# EAGLE schematic EurocardBackplane (EAGLE 6.6.0)

## Sheet 1 of 8
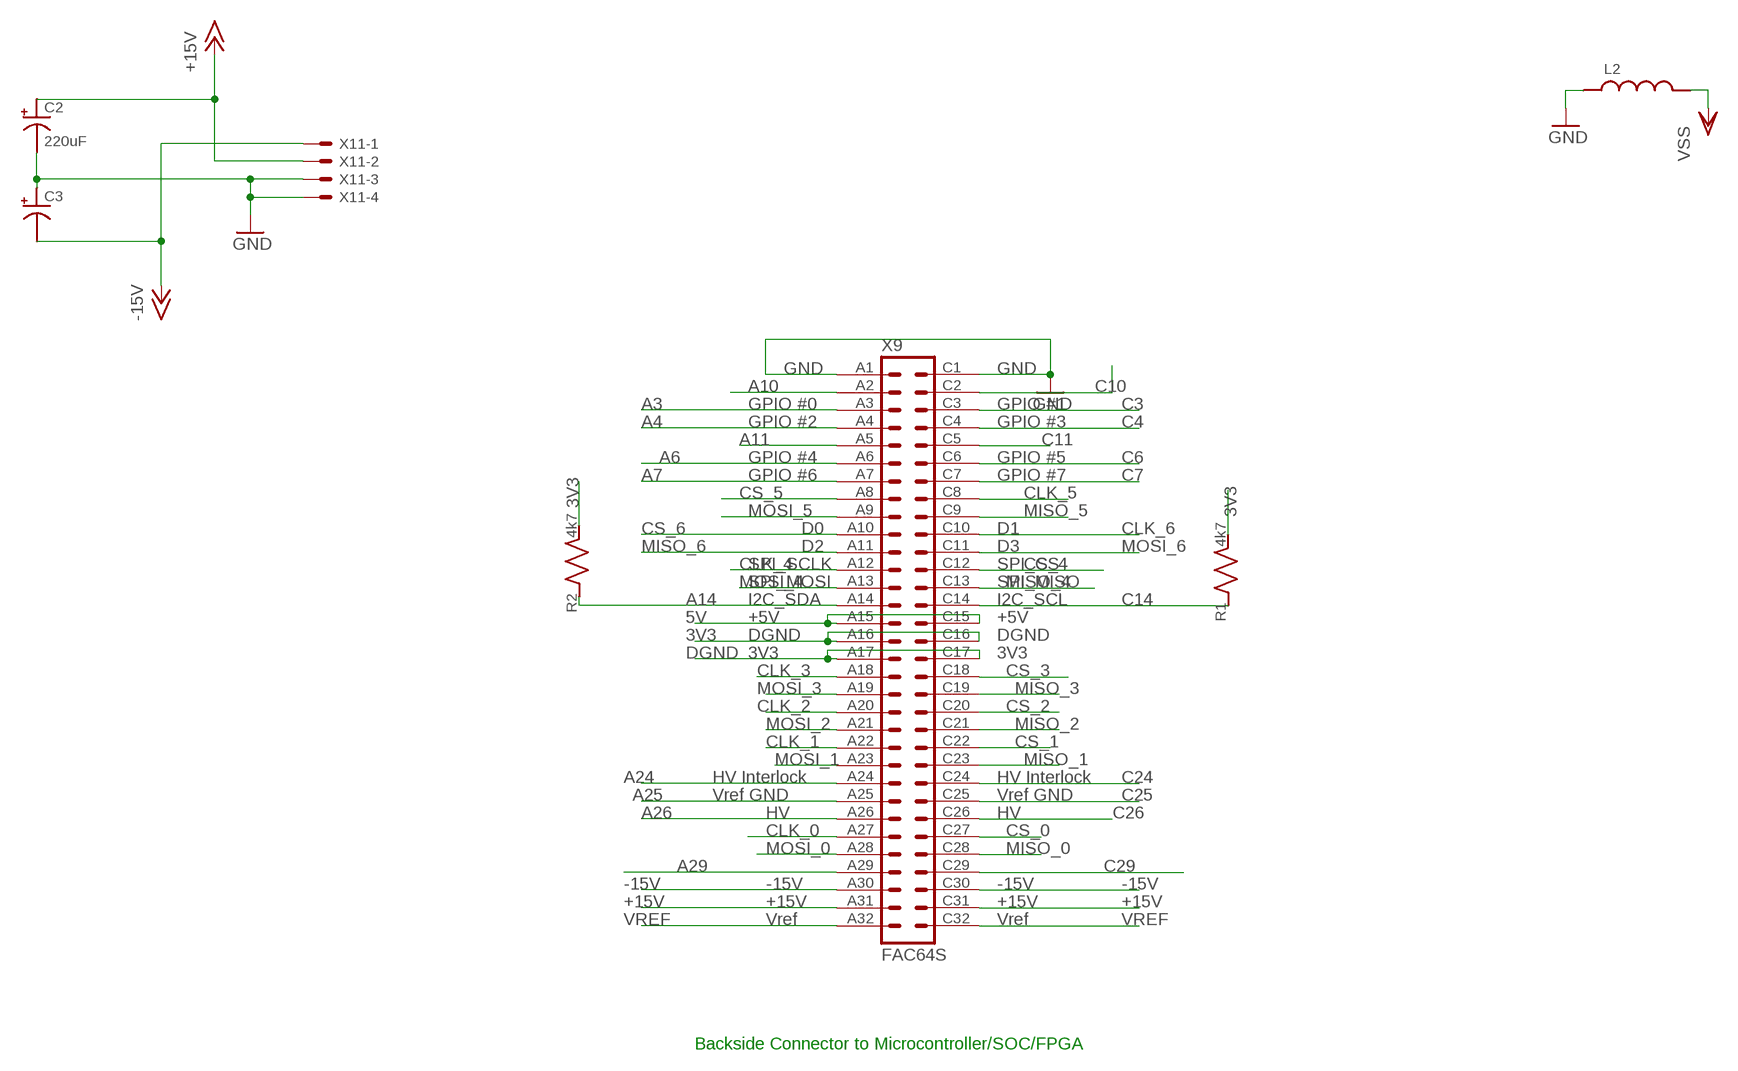
[diagram p0: schematic, sheet 1]

### Parts
C2  220uF  C_POL_SMDF  [PANASONIC_F]
C3  C_POL_SMDF  [PANASONIC_F]
L2  L_FERRITE_SMDLFERRITE_0805  [R_0805]
R1  4k7  R_SMDR0603  [R_0603]
R2  4k7  R_SMDR0603  [R_0603]
X9  FAC64S  [FAC64S]
X11  5566-4  [5566-4]

### Nets
3V3: R1.P$2 R2.P$2 X9.A16 X9.C16 ; also sheet 2,3,4,5,6,7,8
5V: X9.A15 X9.C15 ; also sheet 2,3,4,5,6,7,8
+15V: C2.+ X9.A31 X9.C31 X11.2 ; also sheet 2,3,4,5,6,7,8
-15V: C3.- X9.A30 X9.C30 X11.1 ; also sheet 2,3,4,5,6,7,8
A3: X9.A3 ; also sheet 2,3,4,5,6,7,8
A4: X9.A4 ; also sheet 2,3,4,5,6,7,8
A6: X9.A6 ; also sheet 2,3,4,5,6,7,8
A7: X9.A7 ; also sheet 2,3,4,5,6,7,8
A10: X9.A2 ; also sheet 2,3,4,5,6,7,8
A11: X9.A5 ; also sheet 2,3,4,5,6,7,8
A14: R2.P$1 X9.A14 ; also sheet 2,3,4,5,6,7,8
A24: X9.A24 ; also sheet 2,3,4,5,6,7,8
A25: X9.A25 ; also sheet 2,3,4,5,6,7,8
A26: X9.A26 ; also sheet 2,3,4,5,6,7,8
A29: X9.A29 ; also sheet 2,3,4,5,6,7,8
C3: X9.C3 ; also sheet 2,3,4,5,6,7,8
C4: X9.C4 ; also sheet 2,3,4,5,6,7,8
C6: X9.C6 ; also sheet 2,3,4,5,6,7,8
C7: X9.C7 ; also sheet 2,3,4,5,6,7,8
C10: X9.C2 ; also sheet 2,3,4,5,6,7,8
C11: X9.C5 ; also sheet 2,3,4,5,6,7,8
C14: R1.P$1 X9.C14 ; also sheet 2,3,4,5,6,7,8
C24: X9.C24 ; also sheet 2,3,4,5,6,7,8
C25: X9.C25 ; also sheet 2,3,4,5,6,7,8
C26: X9.C26 ; also sheet 2,3,4,5,6,7,8
C29: X9.C29 ; also sheet 2,3,4,5,6,7,8
CLK_0: X9.A27 ; also sheet 2
CLK_1: X9.A22 ; also sheet 3
CLK_2: X9.A20 ; also sheet 4
CLK_3: X9.A18 ; also sheet 5
CLK_4: X9.A12 ; also sheet 6
CLK_5: X9.C8 ; also sheet 7
CLK_6: X9.C10 ; also sheet 8
CS_0: X9.C27 ; also sheet 2
CS_1: X9.C22 ; also sheet 3
CS_2: X9.C20 ; also sheet 4
CS_3: X9.C18 ; also sheet 5
CS_4: X9.C12 ; also sheet 6
CS_5: X9.A8 ; also sheet 7
CS_6: X9.A10 ; also sheet 8
DGND: X9.A17 X9.C17 ; also sheet 2,3,4,5,6,7,8
GND: C2.- C3.+ L2.P$1 X9.A1 X9.C1 X11.3 X11.4 ; also sheet 2,3,4,5,6,7,8
MISO_0: X9.C28 ; also sheet 2
MISO_1: X9.C23 ; also sheet 3
MISO_2: X9.C21 ; also sheet 4
MISO_3: X9.C19 ; also sheet 5
MISO_4: X9.C13 ; also sheet 6
MISO_5: X9.C9 ; also sheet 7
MISO_6: X9.A11 ; also sheet 8
MOSI_0: X9.A28 ; also sheet 2
MOSI_1: X9.A23 ; also sheet 3
MOSI_2: X9.A21 ; also sheet 4
MOSI_3: X9.A19 ; also sheet 5
MOSI_4: X9.A13 ; also sheet 6
MOSI_5: X9.A9 ; also sheet 7
MOSI_6: X9.C11 ; also sheet 8
VREF: X9.A32 X9.C32
VSS: L2.P$2

### Notes on the sheet
- Backside Connector to Microcontroller/SOC/FPGA

## Sheet 2 of 8
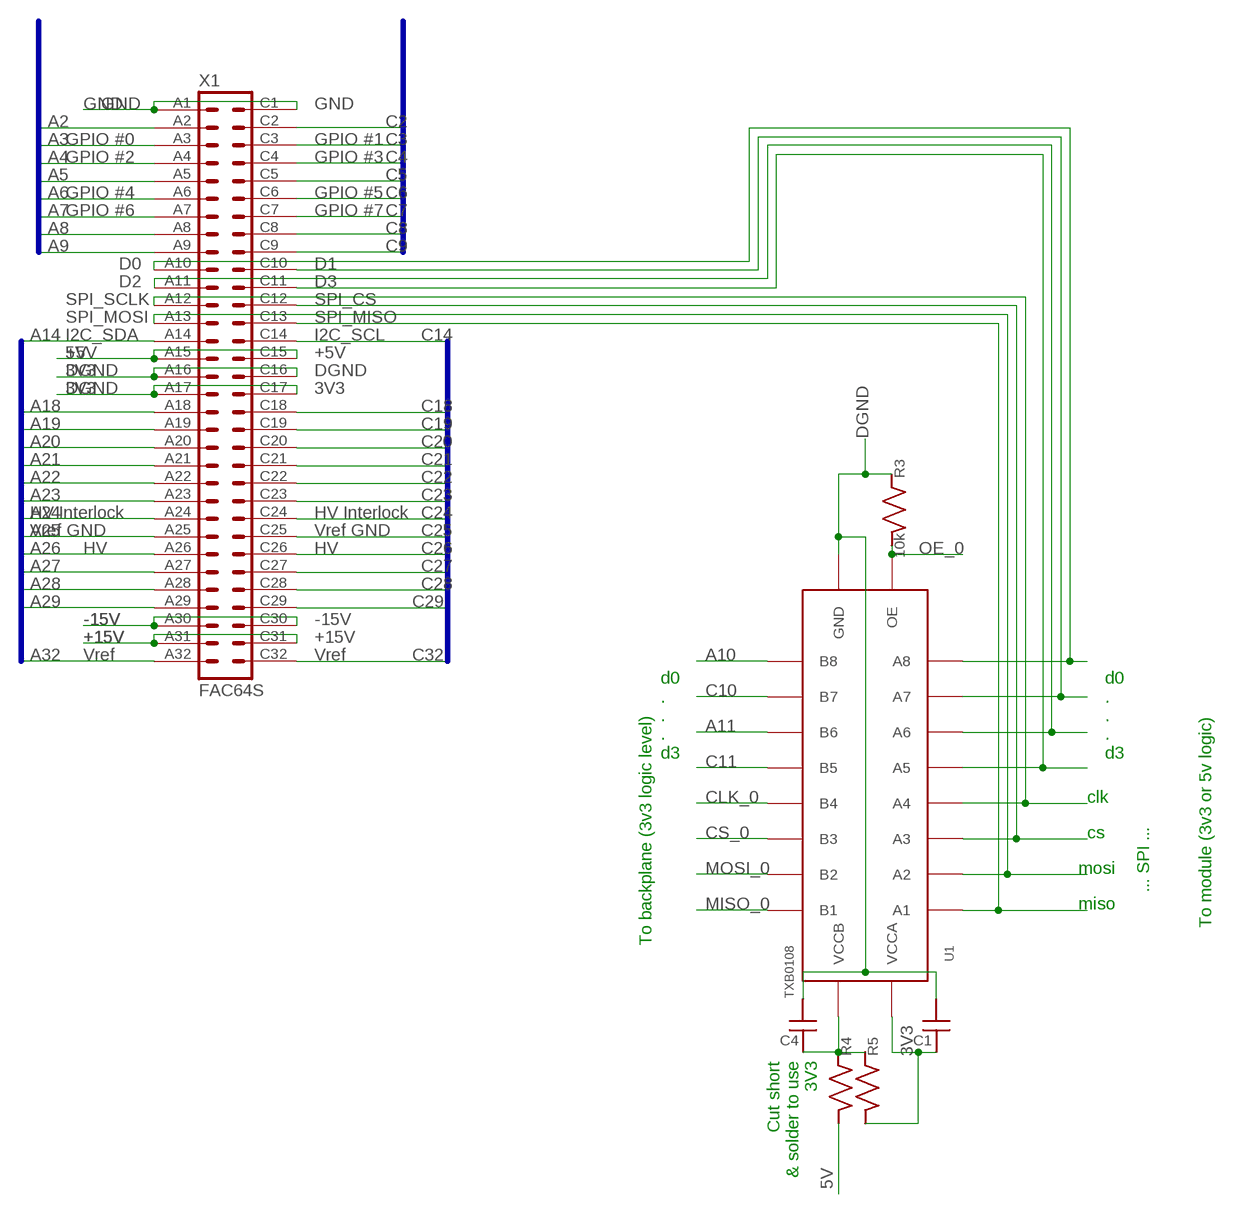
[diagram p1: schematic, sheet 2]

### Parts
C1  C_MLCC_SMDCMLCC_0603  [C_MLCC_0603]
C4  C_MLCC_SMDCMLCC_0603  [C_MLCC_0603]
R3  10k  R_SMDR0603  [R_0603]
R4  R_SMDR0603  [R_0603]
R5  R_SMDR0603  [R_0603]
U1  TXB0108  [TSSOP20]
X1  FAC64S  [FAC64S]

### Nets
3V3: C1.P$1 R5.P$2 U1.2(VCCA) X1.A16 X1.C16 ; also sheet 1,3,4,5,6,7,8
5V: R4.P$2 X1.A15 X1.C15 ; also sheet 1,3,4,5,6,7,8
+15V: X1.A31 X1.C31 ; also sheet 1,3,4,5,6,7,8
-15V: X1.A30 X1.C30 ; also sheet 1,3,4,5,6,7,8
A2: X1.A2 ; also sheet 3,4,5,6,7,8
A3: X1.A3 ; also sheet 1,3,4,5,6,7,8
A4: X1.A4 ; also sheet 1,3,4,5,6,7,8
A5: X1.A5 ; also sheet 3,4,5,6,7,8
A6: X1.A6 ; also sheet 1,3,4,5,6,7,8
A7: X1.A7 ; also sheet 1,3,4,5,6,7,8
A8: X1.A8 ; also sheet 3,4,5,6,7,8
A9: X1.A9 ; also sheet 3,4,5,6,7,8
A10: U1.12(B8) ; also sheet 1,3,4,5,6,7,8
A11: U1.14(B6) ; also sheet 1,3,4,5,6,7,8
A14: X1.A14 ; also sheet 1,3,4,5,6,7,8
A18: X1.A18 ; also sheet 3,4,5,6,7,8
A19: X1.A19 ; also sheet 3,4,5,6,7,8
A20: X1.A20 ; also sheet 3,4,5,6,7,8
A21: X1.A21 ; also sheet 3,4,5,6,7,8
A22: X1.A22 ; also sheet 3,4,5,6,7,8
A23: X1.A23 ; also sheet 3,4,5,6,7,8
A24: X1.A24 ; also sheet 1,3,4,5,6,7,8
A25: X1.A25 ; also sheet 1,3,4,5,6,7,8
A26: X1.A26 ; also sheet 1,3,4,5,6,7,8
A27: X1.A27 ; also sheet 3,4,5,6,7,8
A28: X1.A28 ; also sheet 3,4,5,6,7,8
A29: X1.A29 ; also sheet 1,3,4,5,6,7,8
A32: X1.A32 ; also sheet 3,4,5,6,7,8
C2: X1.C2 ; also sheet 3,4,5,6,7,8
C3: X1.C3 ; also sheet 1,3,4,5,6,7,8
C4: X1.C4 ; also sheet 1,3,4,5,6,7,8
C5: X1.C5 ; also sheet 3,4,5,6,7,8
C6: X1.C6 ; also sheet 1,3,4,5,6,7,8
C7: X1.C7 ; also sheet 1,3,4,5,6,7,8
C8: X1.C8 ; also sheet 3,4,5,6,7,8
C9: X1.C9 ; also sheet 3,4,5,6,7,8
C10: U1.13(B7) ; also sheet 1,3,4,5,6,7,8
C11: U1.15(B5) ; also sheet 1,3,4,5,6,7,8
C14: X1.C14 ; also sheet 1,3,4,5,6,7,8
C18: X1.C18 ; also sheet 3,4,5,6,7,8
C19: X1.C19 ; also sheet 3,4,5,6,7,8
C20: X1.C20 ; also sheet 3,4,5,6,7,8
C21: X1.C21 ; also sheet 3,4,5,6,7,8
C22: X1.C22 ; also sheet 3,4,5,6,7,8
C23: X1.C23 ; also sheet 3,4,5,6,7,8
C24: X1.C24 ; also sheet 1,3,4,5,6,7,8
C25: X1.C25 ; also sheet 1,3,4,5,6,7,8
C26: X1.C26 ; also sheet 1,3,4,5,6,7,8
C27: X1.C27 ; also sheet 3,4,5,6,7,8
C28: X1.C28 ; also sheet 3,4,5,6,7,8
C29: X1.C29 ; also sheet 1,3,4,5,6,7,8
C32: X1.C32 ; also sheet 3,4,5,6,7,8
CLK_0: U1.16(B4) ; also sheet 1
CS_0: U1.17(B3) ; also sheet 1
DGND: C1.P$2 C4.P$2 R3.P$1 U1.11(GND) X1.A17 X1.C17 ; also sheet 1,3,4,5,6,7,8
GND: X1.A1 X1.C1 ; also sheet 1,3,4,5,6,7,8
MISO_0: U1.20(B1) ; also sheet 1
MOSI_0: U1.18(B2) ; also sheet 1
N$1: U1.9(A8) X1.A10
N$2: U1.8(A7) X1.C10
N$3: U1.7(A6) X1.A11
N$4: U1.6(A5) X1.C11
N$5: U1.5(A4) X1.A12
N$6: U1.4(A3) X1.C12
N$7: U1.3(A2) X1.A13
N$8: U1.1(A1) X1.C13
N$9: C4.P$1 R4.P$1 R5.P$1 U1.19(VCCB)
OE_0: R3.P$2 U1.10(OE)

### Buses
A[1..32],C[1..32]

### Notes on the sheet
- d0
  .
  .
  .
  d3
- d0
  .
  .
  .
  d3
- clk
- cs
- mosi
- ... SPI ...
- miso
- To module (3v3 or 5v logic)
- To backplane (3v3 logic level)
- Cut short
  & solder to use
  3V3

## Sheet 3 of 8
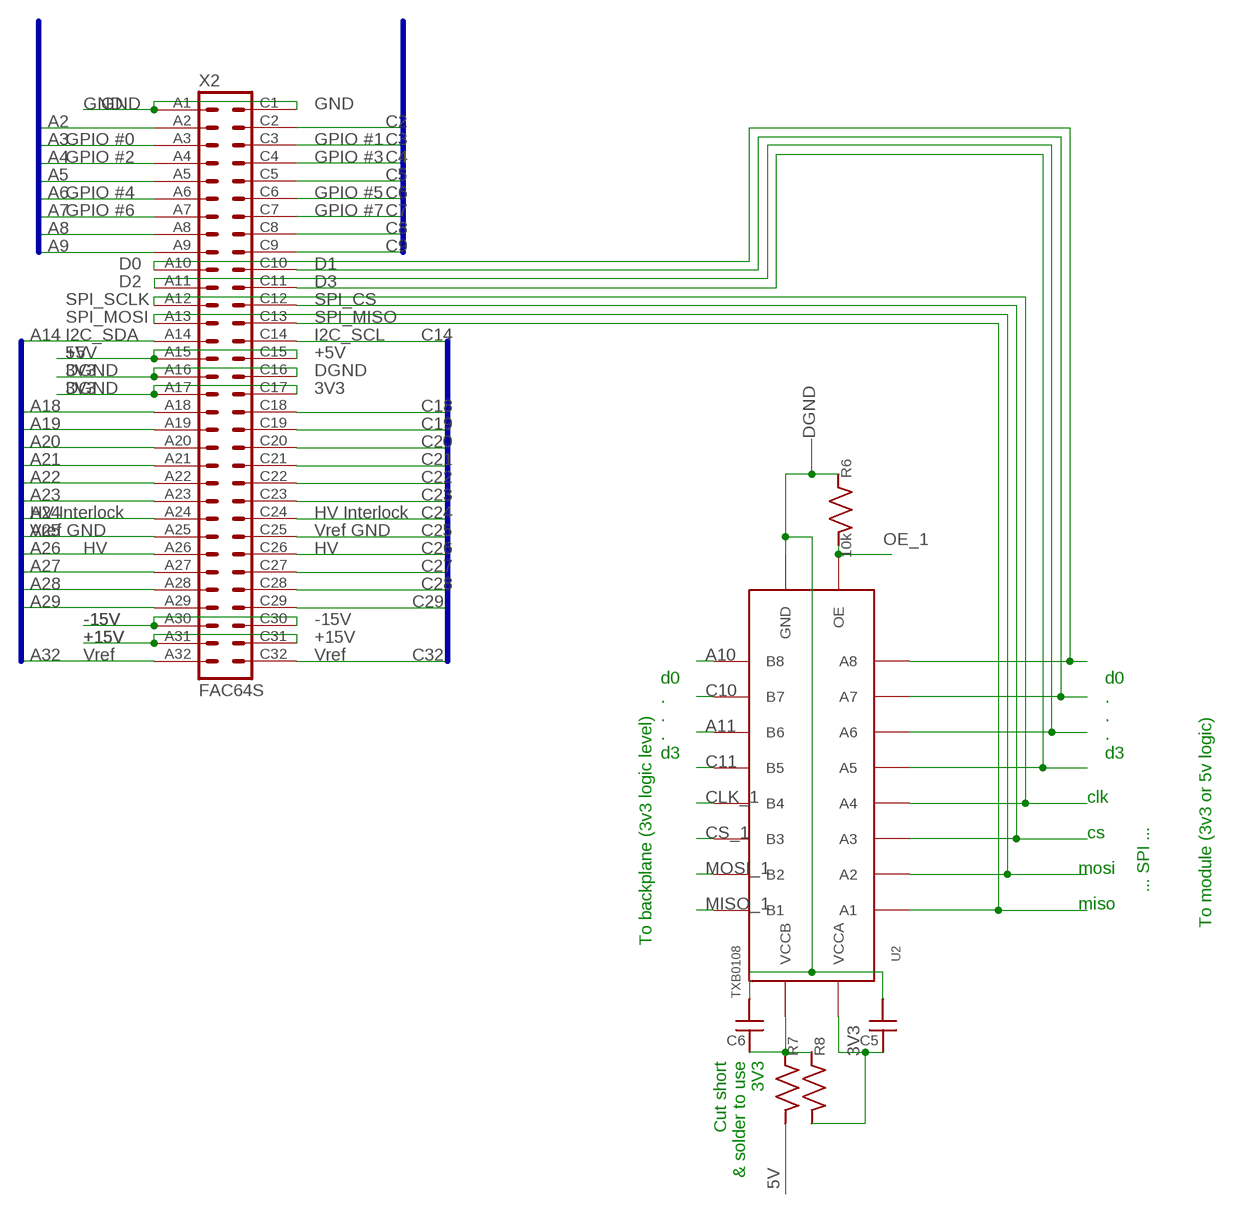
[diagram p2: schematic, sheet 3]

### Parts
C5  C_MLCC_SMDCMLCC_0603  [C_MLCC_0603]
C6  C_MLCC_SMDCMLCC_0603  [C_MLCC_0603]
R6  10k  R_SMDR0603  [R_0603]
R7  R_SMDR0603  [R_0603]
R8  R_SMDR0603  [R_0603]
U2  TXB0108  [TSSOP20]
X2  FAC64S  [FAC64S]

### Nets
3V3: C5.P$1 R8.P$2 U2.2(VCCA) X2.A16 X2.C16 ; also sheet 1,2,4,5,6,7,8
5V: R7.P$2 X2.A15 X2.C15 ; also sheet 1,2,4,5,6,7,8
+15V: X2.A31 X2.C31 ; also sheet 1,2,4,5,6,7,8
-15V: X2.A30 X2.C30 ; also sheet 1,2,4,5,6,7,8
A2: X2.A2 ; also sheet 2,4,5,6,7,8
A3: X2.A3 ; also sheet 1,2,4,5,6,7,8
A4: X2.A4 ; also sheet 1,2,4,5,6,7,8
A5: X2.A5 ; also sheet 2,4,5,6,7,8
A6: X2.A6 ; also sheet 1,2,4,5,6,7,8
A7: X2.A7 ; also sheet 1,2,4,5,6,7,8
A8: X2.A8 ; also sheet 2,4,5,6,7,8
A9: X2.A9 ; also sheet 2,4,5,6,7,8
A10: U2.12(B8) ; also sheet 1,2,4,5,6,7,8
A11: U2.14(B6) ; also sheet 1,2,4,5,6,7,8
A14: X2.A14 ; also sheet 1,2,4,5,6,7,8
A18: X2.A18 ; also sheet 2,4,5,6,7,8
A19: X2.A19 ; also sheet 2,4,5,6,7,8
A20: X2.A20 ; also sheet 2,4,5,6,7,8
A21: X2.A21 ; also sheet 2,4,5,6,7,8
A22: X2.A22 ; also sheet 2,4,5,6,7,8
A23: X2.A23 ; also sheet 2,4,5,6,7,8
A24: X2.A24 ; also sheet 1,2,4,5,6,7,8
A25: X2.A25 ; also sheet 1,2,4,5,6,7,8
A26: X2.A26 ; also sheet 1,2,4,5,6,7,8
A27: X2.A27 ; also sheet 2,4,5,6,7,8
A28: X2.A28 ; also sheet 2,4,5,6,7,8
A29: X2.A29 ; also sheet 1,2,4,5,6,7,8
A32: X2.A32 ; also sheet 2,4,5,6,7,8
C2: X2.C2 ; also sheet 2,4,5,6,7,8
C3: X2.C3 ; also sheet 1,2,4,5,6,7,8
C4: X2.C4 ; also sheet 1,2,4,5,6,7,8
C5: X2.C5 ; also sheet 2,4,5,6,7,8
C6: X2.C6 ; also sheet 1,2,4,5,6,7,8
C7: X2.C7 ; also sheet 1,2,4,5,6,7,8
C8: X2.C8 ; also sheet 2,4,5,6,7,8
C9: X2.C9 ; also sheet 2,4,5,6,7,8
C10: U2.13(B7) ; also sheet 1,2,4,5,6,7,8
C11: U2.15(B5) ; also sheet 1,2,4,5,6,7,8
C14: X2.C14 ; also sheet 1,2,4,5,6,7,8
C18: X2.C18 ; also sheet 2,4,5,6,7,8
C19: X2.C19 ; also sheet 2,4,5,6,7,8
C20: X2.C20 ; also sheet 2,4,5,6,7,8
C21: X2.C21 ; also sheet 2,4,5,6,7,8
C22: X2.C22 ; also sheet 2,4,5,6,7,8
C23: X2.C23 ; also sheet 2,4,5,6,7,8
C24: X2.C24 ; also sheet 1,2,4,5,6,7,8
C25: X2.C25 ; also sheet 1,2,4,5,6,7,8
C26: X2.C26 ; also sheet 1,2,4,5,6,7,8
C27: X2.C27 ; also sheet 2,4,5,6,7,8
C28: X2.C28 ; also sheet 2,4,5,6,7,8
C29: X2.C29 ; also sheet 1,2,4,5,6,7,8
C32: X2.C32 ; also sheet 2,4,5,6,7,8
CLK_1: U2.16(B4) ; also sheet 1
CS_1: U2.17(B3) ; also sheet 1
DGND: C5.P$2 C6.P$2 R6.P$1 U2.11(GND) X2.A17 X2.C17 ; also sheet 1,2,4,5,6,7,8
GND: X2.A1 X2.C1 ; also sheet 1,2,4,5,6,7,8
MISO_1: U2.20(B1) ; also sheet 1
MOSI_1: U2.18(B2) ; also sheet 1
N$10: U2.9(A8) X2.A10
N$11: U2.8(A7) X2.C10
N$12: U2.7(A6) X2.A11
N$13: U2.6(A5) X2.C11
N$14: U2.5(A4) X2.A12
N$15: U2.4(A3) X2.C12
N$16: U2.3(A2) X2.A13
N$17: U2.1(A1) X2.C13
N$18: C6.P$1 R7.P$1 R8.P$1 U2.19(VCCB)
OE_1: R6.P$2 U2.10(OE)

### Buses
A[1..32],C[1..32]

### Notes on the sheet
- d0
  .
  .
  .
  d3
- d0
  .
  .
  .
  d3
- clk
- cs
- mosi
- ... SPI ...
- miso
- To module (3v3 or 5v logic)
- To backplane (3v3 logic level)
- Cut short
  & solder to use
  3V3

## Sheet 4 of 8
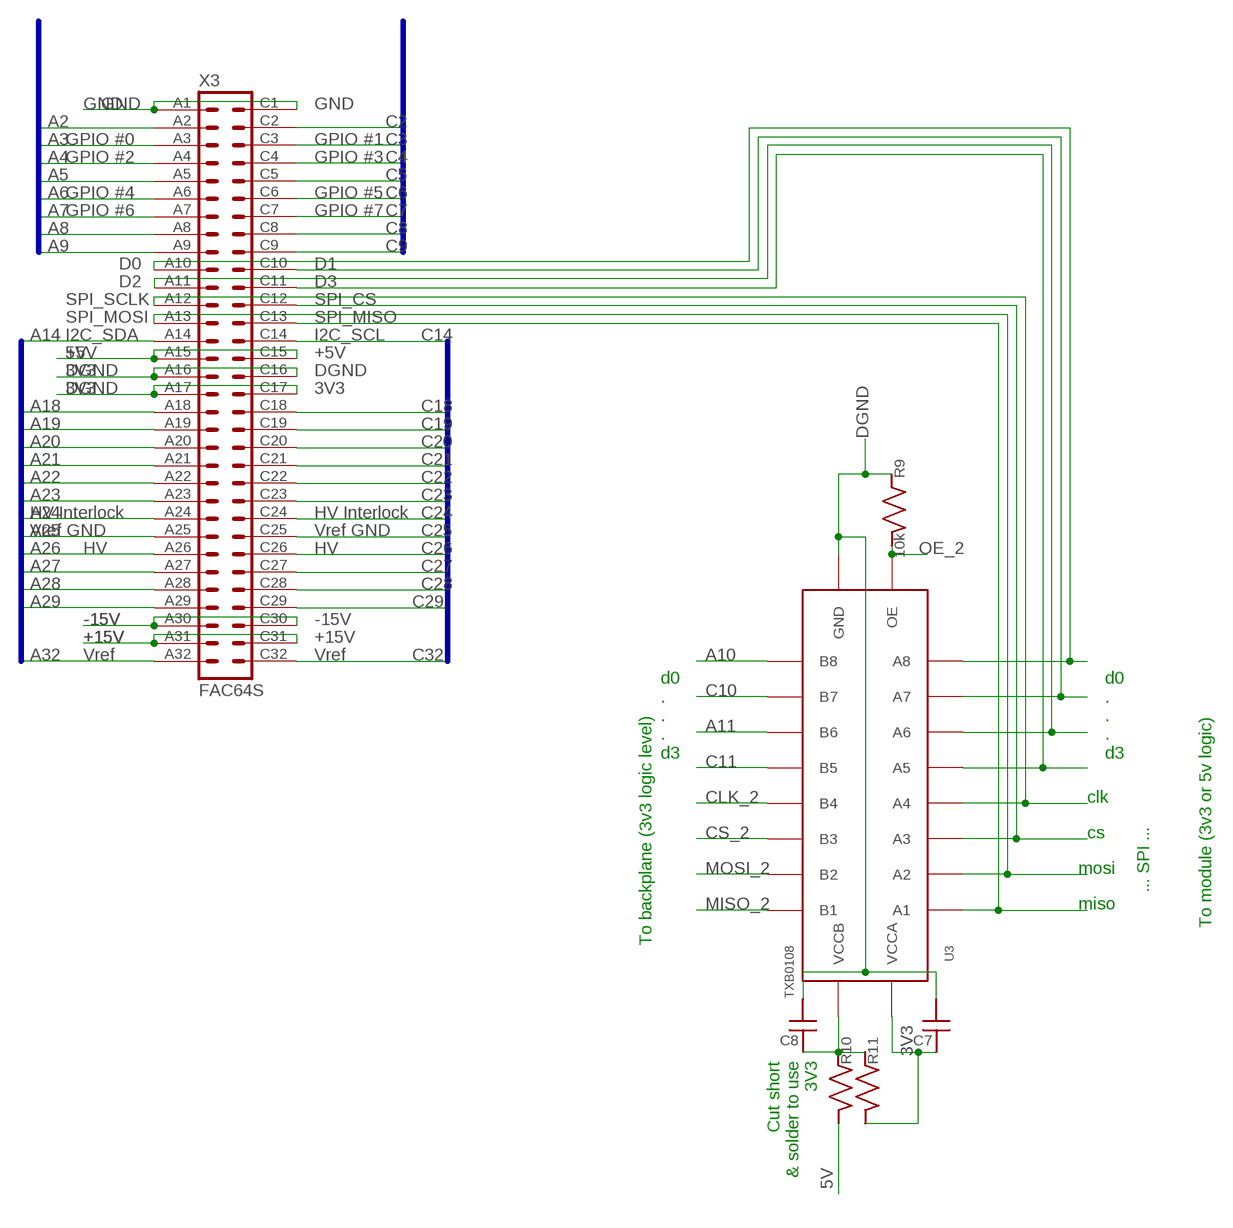
[diagram p3: schematic, sheet 4]

### Parts
C7  C_MLCC_SMDCMLCC_0603  [C_MLCC_0603]
C8  C_MLCC_SMDCMLCC_0603  [C_MLCC_0603]
R9  10k  R_SMDR0603  [R_0603]
R10  R_SMDR0603  [R_0603]
R11  R_SMDR0603  [R_0603]
U3  TXB0108  [TSSOP20]
X3  FAC64S  [FAC64S]

### Nets
3V3: C7.P$1 R11.P$2 U3.2(VCCA) X3.A16 X3.C16 ; also sheet 1,2,3,5,6,7,8
5V: R10.P$2 X3.A15 X3.C15 ; also sheet 1,2,3,5,6,7,8
+15V: X3.A31 X3.C31 ; also sheet 1,2,3,5,6,7,8
-15V: X3.A30 X3.C30 ; also sheet 1,2,3,5,6,7,8
A2: X3.A2 ; also sheet 2,3,5,6,7,8
A3: X3.A3 ; also sheet 1,2,3,5,6,7,8
A4: X3.A4 ; also sheet 1,2,3,5,6,7,8
A5: X3.A5 ; also sheet 2,3,5,6,7,8
A6: X3.A6 ; also sheet 1,2,3,5,6,7,8
A7: X3.A7 ; also sheet 1,2,3,5,6,7,8
A8: X3.A8 ; also sheet 2,3,5,6,7,8
A9: X3.A9 ; also sheet 2,3,5,6,7,8
A10: U3.12(B8) ; also sheet 1,2,3,5,6,7,8
A11: U3.14(B6) ; also sheet 1,2,3,5,6,7,8
A14: X3.A14 ; also sheet 1,2,3,5,6,7,8
A18: X3.A18 ; also sheet 2,3,5,6,7,8
A19: X3.A19 ; also sheet 2,3,5,6,7,8
A20: X3.A20 ; also sheet 2,3,5,6,7,8
A21: X3.A21 ; also sheet 2,3,5,6,7,8
A22: X3.A22 ; also sheet 2,3,5,6,7,8
A23: X3.A23 ; also sheet 2,3,5,6,7,8
A24: X3.A24 ; also sheet 1,2,3,5,6,7,8
A25: X3.A25 ; also sheet 1,2,3,5,6,7,8
A26: X3.A26 ; also sheet 1,2,3,5,6,7,8
A27: X3.A27 ; also sheet 2,3,5,6,7,8
A28: X3.A28 ; also sheet 2,3,5,6,7,8
A29: X3.A29 ; also sheet 1,2,3,5,6,7,8
A32: X3.A32 ; also sheet 2,3,5,6,7,8
C2: X3.C2 ; also sheet 2,3,5,6,7,8
C3: X3.C3 ; also sheet 1,2,3,5,6,7,8
C4: X3.C4 ; also sheet 1,2,3,5,6,7,8
C5: X3.C5 ; also sheet 2,3,5,6,7,8
C6: X3.C6 ; also sheet 1,2,3,5,6,7,8
C7: X3.C7 ; also sheet 1,2,3,5,6,7,8
C8: X3.C8 ; also sheet 2,3,5,6,7,8
C9: X3.C9 ; also sheet 2,3,5,6,7,8
C10: U3.13(B7) ; also sheet 1,2,3,5,6,7,8
C11: U3.15(B5) ; also sheet 1,2,3,5,6,7,8
C14: X3.C14 ; also sheet 1,2,3,5,6,7,8
C18: X3.C18 ; also sheet 2,3,5,6,7,8
C19: X3.C19 ; also sheet 2,3,5,6,7,8
C20: X3.C20 ; also sheet 2,3,5,6,7,8
C21: X3.C21 ; also sheet 2,3,5,6,7,8
C22: X3.C22 ; also sheet 2,3,5,6,7,8
C23: X3.C23 ; also sheet 2,3,5,6,7,8
C24: X3.C24 ; also sheet 1,2,3,5,6,7,8
C25: X3.C25 ; also sheet 1,2,3,5,6,7,8
C26: X3.C26 ; also sheet 1,2,3,5,6,7,8
C27: X3.C27 ; also sheet 2,3,5,6,7,8
C28: X3.C28 ; also sheet 2,3,5,6,7,8
C29: X3.C29 ; also sheet 1,2,3,5,6,7,8
C32: X3.C32 ; also sheet 2,3,5,6,7,8
CLK_2: U3.16(B4) ; also sheet 1
CS_2: U3.17(B3) ; also sheet 1
DGND: C7.P$2 C8.P$2 R9.P$1 U3.11(GND) X3.A17 X3.C17 ; also sheet 1,2,3,5,6,7,8
GND: X3.A1 X3.C1 ; also sheet 1,2,3,5,6,7,8
MISO_2: U3.20(B1) ; also sheet 1
MOSI_2: U3.18(B2) ; also sheet 1
N$19: U3.9(A8) X3.A10
N$20: U3.8(A7) X3.C10
N$21: U3.7(A6) X3.A11
N$22: U3.6(A5) X3.C11
N$23: U3.5(A4) X3.A12
N$24: U3.4(A3) X3.C12
N$25: U3.3(A2) X3.A13
N$26: U3.1(A1) X3.C13
N$27: C8.P$1 R10.P$1 R11.P$1 U3.19(VCCB)
OE_2: R9.P$2 U3.10(OE)

### Buses
A[1..32],C[1..32]

### Notes on the sheet
- d0
  .
  .
  .
  d3
- d0
  .
  .
  .
  d3
- clk
- cs
- mosi
- ... SPI ...
- miso
- To module (3v3 or 5v logic)
- To backplane (3v3 logic level)
- Cut short
  & solder to use
  3V3

## Sheet 5 of 8
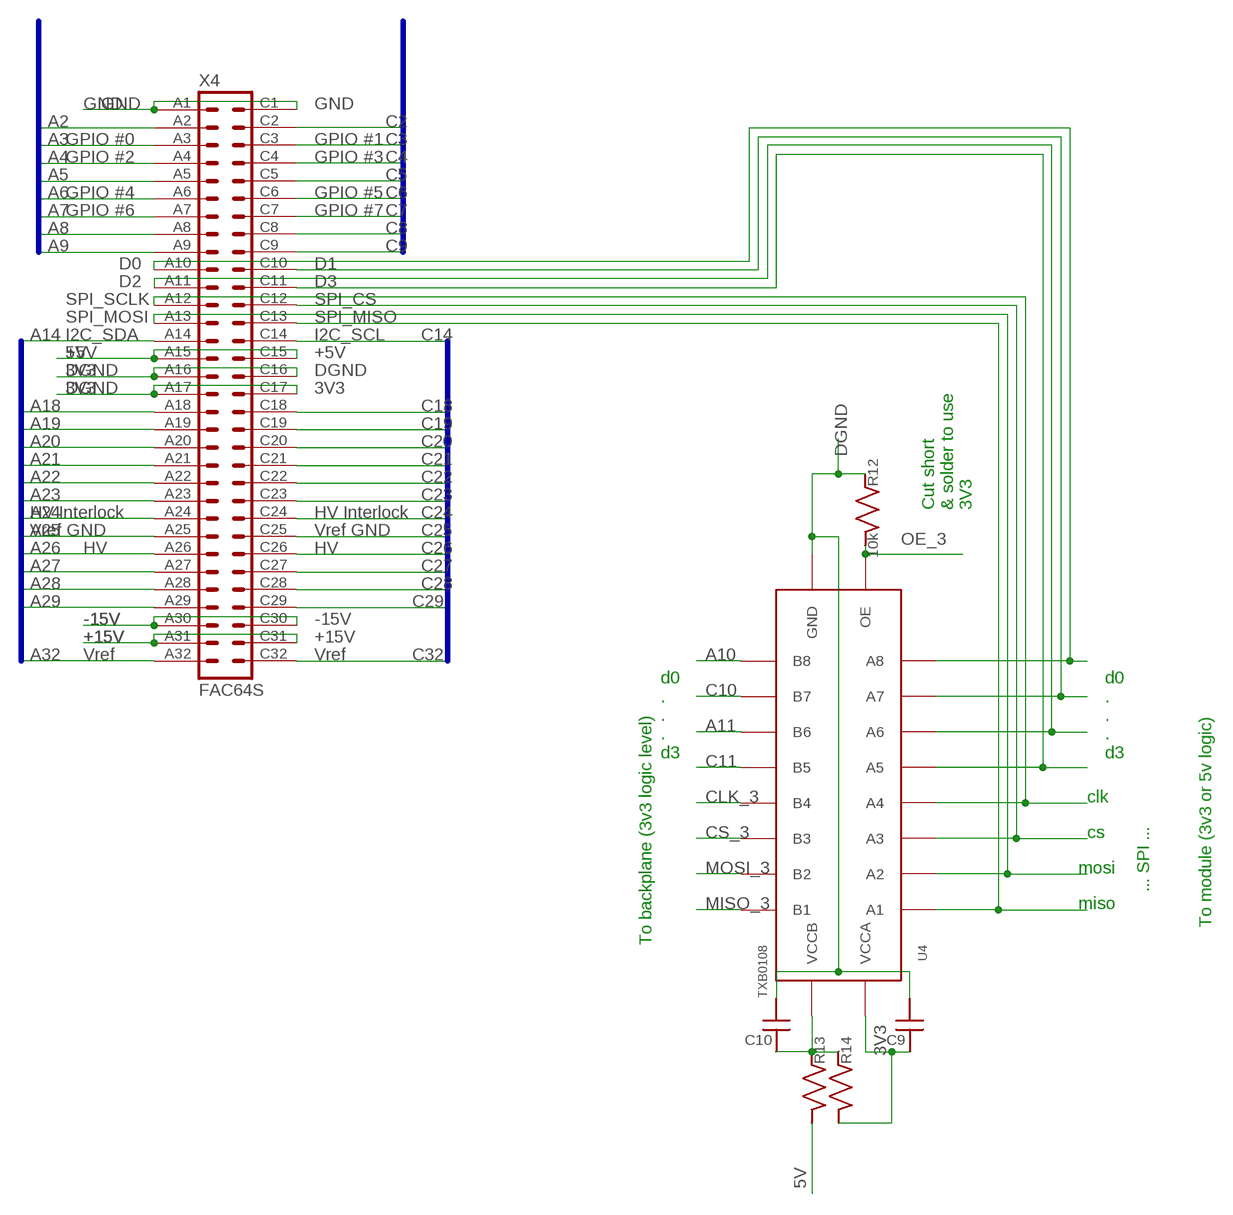
[diagram p4: schematic, sheet 5]

### Parts
C9  C_MLCC_SMDCMLCC_0603  [C_MLCC_0603]
C10  C_MLCC_SMDCMLCC_0603  [C_MLCC_0603]
R12  10k  R_SMDR0603  [R_0603]
R13  R_SMDR0603  [R_0603]
R14  R_SMDR0603  [R_0603]
U4  TXB0108  [TSSOP20]
X4  FAC64S  [FAC64S]

### Nets
3V3: C9.P$1 R14.P$2 U4.2(VCCA) X4.A16 X4.C16 ; also sheet 1,2,3,4,6,7,8
5V: R13.P$2 X4.A15 X4.C15 ; also sheet 1,2,3,4,6,7,8
+15V: X4.A31 X4.C31 ; also sheet 1,2,3,4,6,7,8
-15V: X4.A30 X4.C30 ; also sheet 1,2,3,4,6,7,8
A2: X4.A2 ; also sheet 2,3,4,6,7,8
A3: X4.A3 ; also sheet 1,2,3,4,6,7,8
A4: X4.A4 ; also sheet 1,2,3,4,6,7,8
A5: X4.A5 ; also sheet 2,3,4,6,7,8
A6: X4.A6 ; also sheet 1,2,3,4,6,7,8
A7: X4.A7 ; also sheet 1,2,3,4,6,7,8
A8: X4.A8 ; also sheet 2,3,4,6,7,8
A9: X4.A9 ; also sheet 2,3,4,6,7,8
A10: U4.12(B8) ; also sheet 1,2,3,4,6,7,8
A11: U4.14(B6) ; also sheet 1,2,3,4,6,7,8
A14: X4.A14 ; also sheet 1,2,3,4,6,7,8
A18: X4.A18 ; also sheet 2,3,4,6,7,8
A19: X4.A19 ; also sheet 2,3,4,6,7,8
A20: X4.A20 ; also sheet 2,3,4,6,7,8
A21: X4.A21 ; also sheet 2,3,4,6,7,8
A22: X4.A22 ; also sheet 2,3,4,6,7,8
A23: X4.A23 ; also sheet 2,3,4,6,7,8
A24: X4.A24 ; also sheet 1,2,3,4,6,7,8
A25: X4.A25 ; also sheet 1,2,3,4,6,7,8
A26: X4.A26 ; also sheet 1,2,3,4,6,7,8
A27: X4.A27 ; also sheet 2,3,4,6,7,8
A28: X4.A28 ; also sheet 2,3,4,6,7,8
A29: X4.A29 ; also sheet 1,2,3,4,6,7,8
A32: X4.A32 ; also sheet 2,3,4,6,7,8
C2: X4.C2 ; also sheet 2,3,4,6,7,8
C3: X4.C3 ; also sheet 1,2,3,4,6,7,8
C4: X4.C4 ; also sheet 1,2,3,4,6,7,8
C5: X4.C5 ; also sheet 2,3,4,6,7,8
C6: X4.C6 ; also sheet 1,2,3,4,6,7,8
C7: X4.C7 ; also sheet 1,2,3,4,6,7,8
C8: X4.C8 ; also sheet 2,3,4,6,7,8
C9: X4.C9 ; also sheet 2,3,4,6,7,8
C10: U4.13(B7) ; also sheet 1,2,3,4,6,7,8
C11: U4.15(B5) ; also sheet 1,2,3,4,6,7,8
C14: X4.C14 ; also sheet 1,2,3,4,6,7,8
C18: X4.C18 ; also sheet 2,3,4,6,7,8
C19: X4.C19 ; also sheet 2,3,4,6,7,8
C20: X4.C20 ; also sheet 2,3,4,6,7,8
C21: X4.C21 ; also sheet 2,3,4,6,7,8
C22: X4.C22 ; also sheet 2,3,4,6,7,8
C23: X4.C23 ; also sheet 2,3,4,6,7,8
C24: X4.C24 ; also sheet 1,2,3,4,6,7,8
C25: X4.C25 ; also sheet 1,2,3,4,6,7,8
C26: X4.C26 ; also sheet 1,2,3,4,6,7,8
C27: X4.C27 ; also sheet 2,3,4,6,7,8
C28: X4.C28 ; also sheet 2,3,4,6,7,8
C29: X4.C29 ; also sheet 1,2,3,4,6,7,8
C32: X4.C32 ; also sheet 2,3,4,6,7,8
CLK_3: U4.16(B4) ; also sheet 1
CS_3: U4.17(B3) ; also sheet 1
DGND: C9.P$2 C10.P$2 R12.P$1 U4.11(GND) X4.A17 X4.C17 ; also sheet 1,2,3,4,6,7,8
GND: X4.A1 X4.C1 ; also sheet 1,2,3,4,6,7,8
MISO_3: U4.20(B1) ; also sheet 1
MOSI_3: U4.18(B2) ; also sheet 1
N$28: U4.9(A8) X4.A10
N$29: U4.8(A7) X4.C10
N$30: U4.7(A6) X4.A11
N$31: U4.6(A5) X4.C11
N$32: U4.5(A4) X4.A12
N$33: U4.4(A3) X4.C12
N$34: U4.3(A2) X4.A13
N$35: U4.1(A1) X4.C13
N$36: C10.P$1 R13.P$1 R14.P$1 U4.19(VCCB)
OE_3: R12.P$2 U4.10(OE)

### Buses
A[1..32],C[1..32]

### Notes on the sheet
- Cut short
  & solder to use
  3V3
- d0
  .
  .
  .
  d3
- d0
  .
  .
  .
  d3
- clk
- cs
- mosi
- ... SPI ...
- miso
- To module (3v3 or 5v logic)
- To backplane (3v3 logic level)

## Sheet 6 of 8
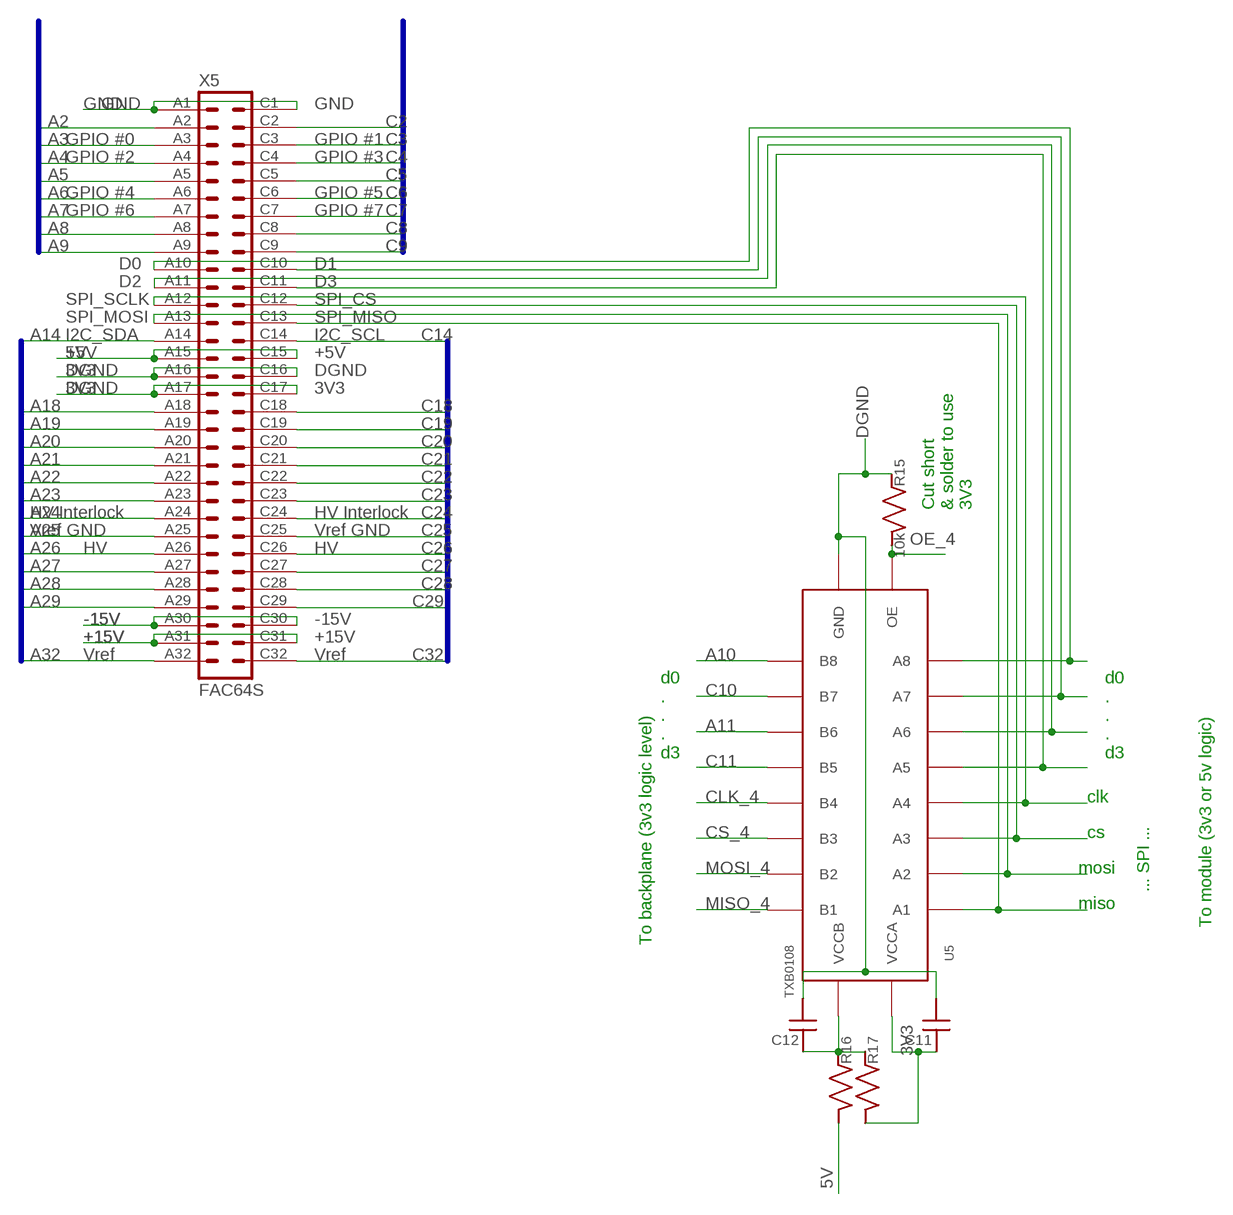
[diagram p5: schematic, sheet 6]

### Parts
C11  C_MLCC_SMDCMLCC_0603  [C_MLCC_0603]
C12  C_MLCC_SMDCMLCC_0603  [C_MLCC_0603]
R15  10k  R_SMDR0603  [R_0603]
R16  R_SMDR0603  [R_0603]
R17  R_SMDR0603  [R_0603]
U5  TXB0108  [TSSOP20]
X5  FAC64S  [FAC64S]

### Nets
3V3: C11.P$1 R17.P$2 U5.2(VCCA) X5.A16 X5.C16 ; also sheet 1,2,3,4,5,7,8
5V: R16.P$2 X5.A15 X5.C15 ; also sheet 1,2,3,4,5,7,8
+15V: X5.A31 X5.C31 ; also sheet 1,2,3,4,5,7,8
-15V: X5.A30 X5.C30 ; also sheet 1,2,3,4,5,7,8
A2: X5.A2 ; also sheet 2,3,4,5,7,8
A3: X5.A3 ; also sheet 1,2,3,4,5,7,8
A4: X5.A4 ; also sheet 1,2,3,4,5,7,8
A5: X5.A5 ; also sheet 2,3,4,5,7,8
A6: X5.A6 ; also sheet 1,2,3,4,5,7,8
A7: X5.A7 ; also sheet 1,2,3,4,5,7,8
A8: X5.A8 ; also sheet 2,3,4,5,7,8
A9: X5.A9 ; also sheet 2,3,4,5,7,8
A10: U5.12(B8) ; also sheet 1,2,3,4,5,7,8
A11: U5.14(B6) ; also sheet 1,2,3,4,5,7,8
A14: X5.A14 ; also sheet 1,2,3,4,5,7,8
A18: X5.A18 ; also sheet 2,3,4,5,7,8
A19: X5.A19 ; also sheet 2,3,4,5,7,8
A20: X5.A20 ; also sheet 2,3,4,5,7,8
A21: X5.A21 ; also sheet 2,3,4,5,7,8
A22: X5.A22 ; also sheet 2,3,4,5,7,8
A23: X5.A23 ; also sheet 2,3,4,5,7,8
A24: X5.A24 ; also sheet 1,2,3,4,5,7,8
A25: X5.A25 ; also sheet 1,2,3,4,5,7,8
A26: X5.A26 ; also sheet 1,2,3,4,5,7,8
A27: X5.A27 ; also sheet 2,3,4,5,7,8
A28: X5.A28 ; also sheet 2,3,4,5,7,8
A29: X5.A29 ; also sheet 1,2,3,4,5,7,8
A32: X5.A32 ; also sheet 2,3,4,5,7,8
C2: X5.C2 ; also sheet 2,3,4,5,7,8
C3: X5.C3 ; also sheet 1,2,3,4,5,7,8
C4: X5.C4 ; also sheet 1,2,3,4,5,7,8
C5: X5.C5 ; also sheet 2,3,4,5,7,8
C6: X5.C6 ; also sheet 1,2,3,4,5,7,8
C7: X5.C7 ; also sheet 1,2,3,4,5,7,8
C8: X5.C8 ; also sheet 2,3,4,5,7,8
C9: X5.C9 ; also sheet 2,3,4,5,7,8
C10: U5.13(B7) ; also sheet 1,2,3,4,5,7,8
C11: U5.15(B5) ; also sheet 1,2,3,4,5,7,8
C14: X5.C14 ; also sheet 1,2,3,4,5,7,8
C18: X5.C18 ; also sheet 2,3,4,5,7,8
C19: X5.C19 ; also sheet 2,3,4,5,7,8
C20: X5.C20 ; also sheet 2,3,4,5,7,8
C21: X5.C21 ; also sheet 2,3,4,5,7,8
C22: X5.C22 ; also sheet 2,3,4,5,7,8
C23: X5.C23 ; also sheet 2,3,4,5,7,8
C24: X5.C24 ; also sheet 1,2,3,4,5,7,8
C25: X5.C25 ; also sheet 1,2,3,4,5,7,8
C26: X5.C26 ; also sheet 1,2,3,4,5,7,8
C27: X5.C27 ; also sheet 2,3,4,5,7,8
C28: X5.C28 ; also sheet 2,3,4,5,7,8
C29: X5.C29 ; also sheet 1,2,3,4,5,7,8
C32: X5.C32 ; also sheet 2,3,4,5,7,8
CLK_4: U5.16(B4) ; also sheet 1
CS_4: U5.17(B3) ; also sheet 1
DGND: C11.P$2 C12.P$2 R15.P$1 U5.11(GND) X5.A17 X5.C17 ; also sheet 1,2,3,4,5,7,8
GND: X5.A1 X5.C1 ; also sheet 1,2,3,4,5,7,8
MISO_4: U5.20(B1) ; also sheet 1
MOSI_4: U5.18(B2) ; also sheet 1
N$37: U5.9(A8) X5.A10
N$38: U5.8(A7) X5.C10
N$39: U5.7(A6) X5.A11
N$40: U5.6(A5) X5.C11
N$41: U5.5(A4) X5.A12
N$42: U5.4(A3) X5.C12
N$43: U5.3(A2) X5.A13
N$44: U5.1(A1) X5.C13
N$45: C12.P$1 R16.P$1 R17.P$1 U5.19(VCCB)
OE_4: R15.P$2 U5.10(OE)

### Buses
A[1..32],C[1..32]

### Notes on the sheet
- Cut short
  & solder to use
  3V3
- d0
  .
  .
  .
  d3
- d0
  .
  .
  .
  d3
- clk
- cs
- mosi
- ... SPI ...
- miso
- To module (3v3 or 5v logic)
- To backplane (3v3 logic level)

## Sheet 7 of 8
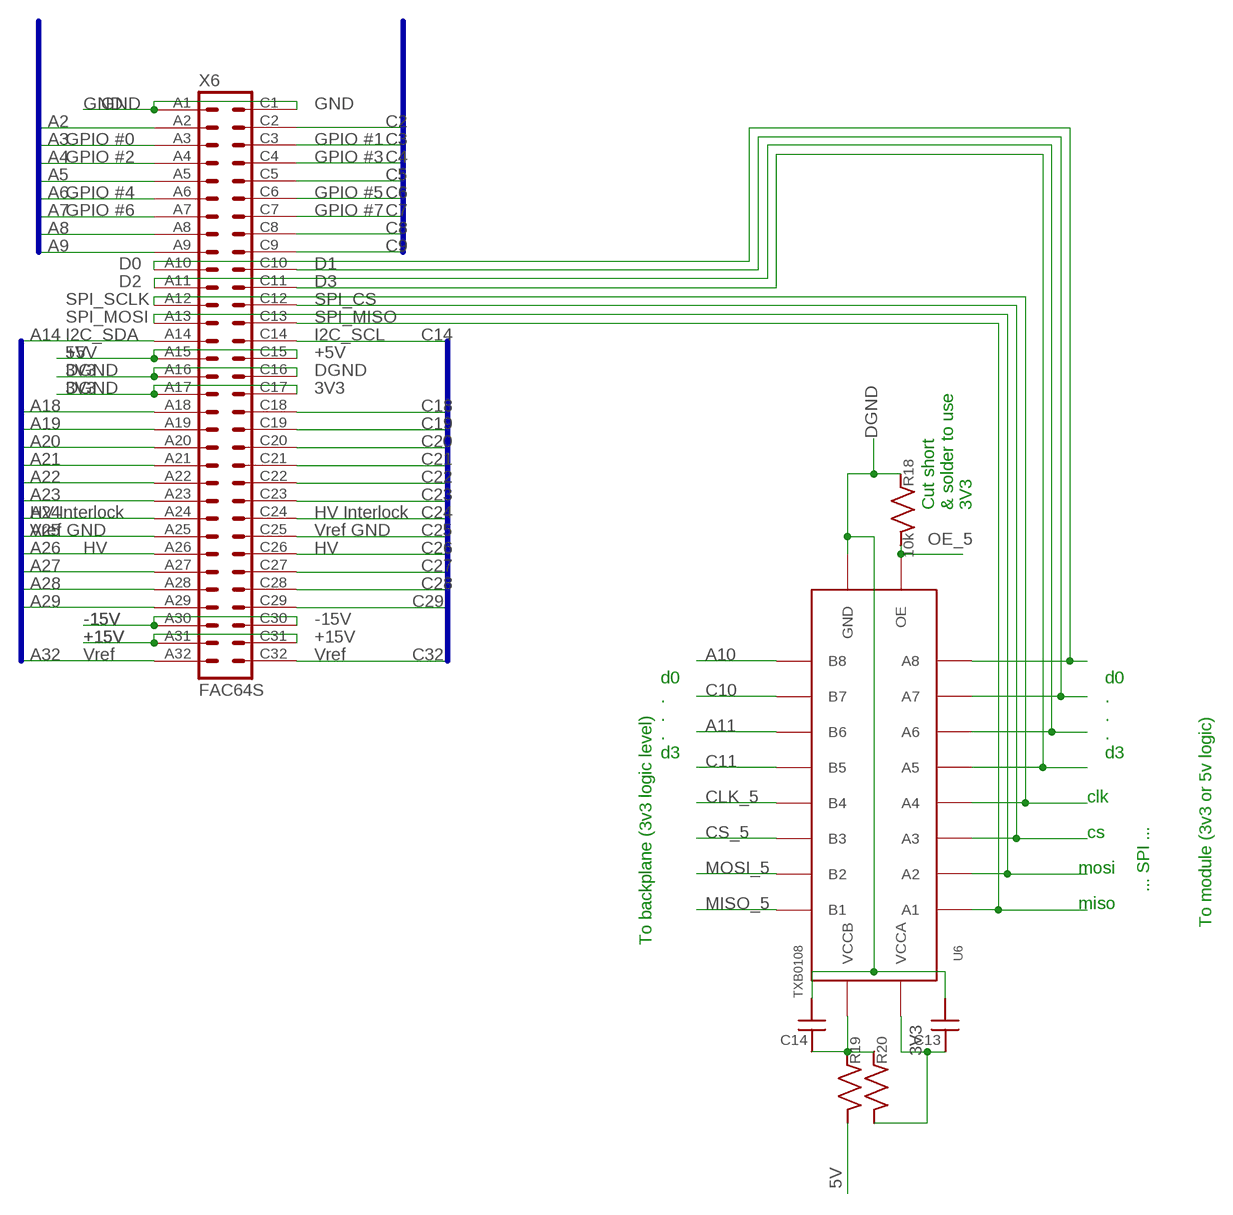
[diagram p6: schematic, sheet 7]

### Parts
C13  C_MLCC_SMDCMLCC_0603  [C_MLCC_0603]
C14  C_MLCC_SMDCMLCC_0603  [C_MLCC_0603]
R18  10k  R_SMDR0603  [R_0603]
R19  R_SMDR0603  [R_0603]
R20  R_SMDR0603  [R_0603]
U6  TXB0108  [TSSOP20]
X6  FAC64S  [FAC64S]

### Nets
3V3: C13.P$1 R20.P$2 U6.2(VCCA) X6.A16 X6.C16 ; also sheet 1,2,3,4,5,6,8
5V: R19.P$2 X6.A15 X6.C15 ; also sheet 1,2,3,4,5,6,8
+15V: X6.A31 X6.C31 ; also sheet 1,2,3,4,5,6,8
-15V: X6.A30 X6.C30 ; also sheet 1,2,3,4,5,6,8
A2: X6.A2 ; also sheet 2,3,4,5,6,8
A3: X6.A3 ; also sheet 1,2,3,4,5,6,8
A4: X6.A4 ; also sheet 1,2,3,4,5,6,8
A5: X6.A5 ; also sheet 2,3,4,5,6,8
A6: X6.A6 ; also sheet 1,2,3,4,5,6,8
A7: X6.A7 ; also sheet 1,2,3,4,5,6,8
A8: X6.A8 ; also sheet 2,3,4,5,6,8
A9: X6.A9 ; also sheet 2,3,4,5,6,8
A10: U6.12(B8) ; also sheet 1,2,3,4,5,6,8
A11: U6.14(B6) ; also sheet 1,2,3,4,5,6,8
A14: X6.A14 ; also sheet 1,2,3,4,5,6,8
A18: X6.A18 ; also sheet 2,3,4,5,6,8
A19: X6.A19 ; also sheet 2,3,4,5,6,8
A20: X6.A20 ; also sheet 2,3,4,5,6,8
A21: X6.A21 ; also sheet 2,3,4,5,6,8
A22: X6.A22 ; also sheet 2,3,4,5,6,8
A23: X6.A23 ; also sheet 2,3,4,5,6,8
A24: X6.A24 ; also sheet 1,2,3,4,5,6,8
A25: X6.A25 ; also sheet 1,2,3,4,5,6,8
A26: X6.A26 ; also sheet 1,2,3,4,5,6,8
A27: X6.A27 ; also sheet 2,3,4,5,6,8
A28: X6.A28 ; also sheet 2,3,4,5,6,8
A29: X6.A29 ; also sheet 1,2,3,4,5,6,8
A32: X6.A32 ; also sheet 2,3,4,5,6,8
C2: X6.C2 ; also sheet 2,3,4,5,6,8
C3: X6.C3 ; also sheet 1,2,3,4,5,6,8
C4: X6.C4 ; also sheet 1,2,3,4,5,6,8
C5: X6.C5 ; also sheet 2,3,4,5,6,8
C6: X6.C6 ; also sheet 1,2,3,4,5,6,8
C7: X6.C7 ; also sheet 1,2,3,4,5,6,8
C8: X6.C8 ; also sheet 2,3,4,5,6,8
C9: X6.C9 ; also sheet 2,3,4,5,6,8
C10: U6.13(B7) ; also sheet 1,2,3,4,5,6,8
C11: U6.15(B5) ; also sheet 1,2,3,4,5,6,8
C14: X6.C14 ; also sheet 1,2,3,4,5,6,8
C18: X6.C18 ; also sheet 2,3,4,5,6,8
C19: X6.C19 ; also sheet 2,3,4,5,6,8
C20: X6.C20 ; also sheet 2,3,4,5,6,8
C21: X6.C21 ; also sheet 2,3,4,5,6,8
C22: X6.C22 ; also sheet 2,3,4,5,6,8
C23: X6.C23 ; also sheet 2,3,4,5,6,8
C24: X6.C24 ; also sheet 1,2,3,4,5,6,8
C25: X6.C25 ; also sheet 1,2,3,4,5,6,8
C26: X6.C26 ; also sheet 1,2,3,4,5,6,8
C27: X6.C27 ; also sheet 2,3,4,5,6,8
C28: X6.C28 ; also sheet 2,3,4,5,6,8
C29: X6.C29 ; also sheet 1,2,3,4,5,6,8
C32: X6.C32 ; also sheet 2,3,4,5,6,8
CLK_5: U6.16(B4) ; also sheet 1
CS_5: U6.17(B3) ; also sheet 1
DGND: C13.P$2 C14.P$2 R18.P$1 U6.11(GND) X6.A17 X6.C17 ; also sheet 1,2,3,4,5,6,8
GND: X6.A1 X6.C1 ; also sheet 1,2,3,4,5,6,8
MISO_5: U6.20(B1) ; also sheet 1
MOSI_5: U6.18(B2) ; also sheet 1
N$46: U6.9(A8) X6.A10
N$47: U6.8(A7) X6.C10
N$48: U6.7(A6) X6.A11
N$49: U6.6(A5) X6.C11
N$50: U6.5(A4) X6.A12
N$51: U6.4(A3) X6.C12
N$52: U6.3(A2) X6.A13
N$53: U6.1(A1) X6.C13
N$54: C14.P$1 R19.P$1 R20.P$1 U6.19(VCCB)
OE_5: R18.P$2 U6.10(OE)

### Buses
A[1..32],C[1..32]

### Notes on the sheet
- Cut short
  & solder to use
  3V3
- d0
  .
  .
  .
  d3
- d0
  .
  .
  .
  d3
- clk
- cs
- mosi
- ... SPI ...
- miso
- To module (3v3 or 5v logic)
- To backplane (3v3 logic level)

## Sheet 8 of 8
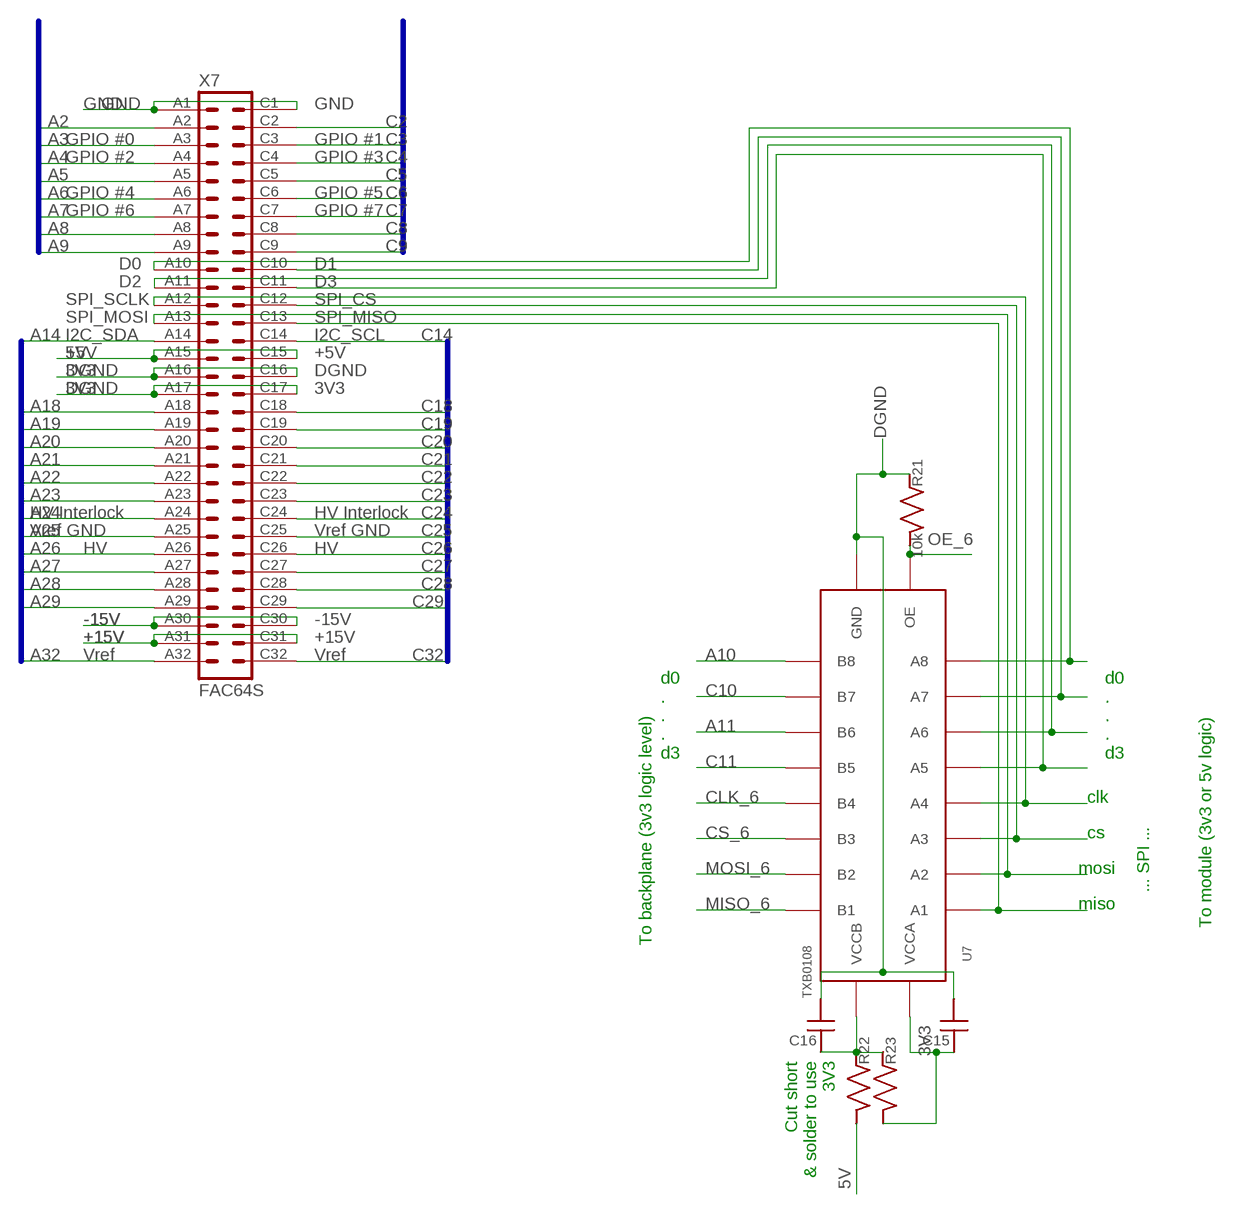
[diagram p7: schematic, sheet 8]

### Parts
C15  C_MLCC_SMDCMLCC_0603  [C_MLCC_0603]
C16  C_MLCC_SMDCMLCC_0603  [C_MLCC_0603]
R21  10k  R_SMDR0603  [R_0603]
R22  R_SMDR0603  [R_0603]
R23  R_SMDR0603  [R_0603]
U7  TXB0108  [TSSOP20]
X7  FAC64S  [FAC64S]

### Nets
3V3: C15.P$1 R23.P$2 U7.2(VCCA) X7.A16 X7.C16 ; also sheet 1,2,3,4,5,6,7
5V: R22.P$2 X7.A15 X7.C15 ; also sheet 1,2,3,4,5,6,7
+15V: X7.A31 X7.C31 ; also sheet 1,2,3,4,5,6,7
-15V: X7.A30 X7.C30 ; also sheet 1,2,3,4,5,6,7
A2: X7.A2 ; also sheet 2,3,4,5,6,7
A3: X7.A3 ; also sheet 1,2,3,4,5,6,7
A4: X7.A4 ; also sheet 1,2,3,4,5,6,7
A5: X7.A5 ; also sheet 2,3,4,5,6,7
A6: X7.A6 ; also sheet 1,2,3,4,5,6,7
A7: X7.A7 ; also sheet 1,2,3,4,5,6,7
A8: X7.A8 ; also sheet 2,3,4,5,6,7
A9: X7.A9 ; also sheet 2,3,4,5,6,7
A10: U7.12(B8) ; also sheet 1,2,3,4,5,6,7
A11: U7.14(B6) ; also sheet 1,2,3,4,5,6,7
A14: X7.A14 ; also sheet 1,2,3,4,5,6,7
A18: X7.A18 ; also sheet 2,3,4,5,6,7
A19: X7.A19 ; also sheet 2,3,4,5,6,7
A20: X7.A20 ; also sheet 2,3,4,5,6,7
A21: X7.A21 ; also sheet 2,3,4,5,6,7
A22: X7.A22 ; also sheet 2,3,4,5,6,7
A23: X7.A23 ; also sheet 2,3,4,5,6,7
A24: X7.A24 ; also sheet 1,2,3,4,5,6,7
A25: X7.A25 ; also sheet 1,2,3,4,5,6,7
A26: X7.A26 ; also sheet 1,2,3,4,5,6,7
A27: X7.A27 ; also sheet 2,3,4,5,6,7
A28: X7.A28 ; also sheet 2,3,4,5,6,7
A29: X7.A29 ; also sheet 1,2,3,4,5,6,7
A32: X7.A32 ; also sheet 2,3,4,5,6,7
C2: X7.C2 ; also sheet 2,3,4,5,6,7
C3: X7.C3 ; also sheet 1,2,3,4,5,6,7
C4: X7.C4 ; also sheet 1,2,3,4,5,6,7
C5: X7.C5 ; also sheet 2,3,4,5,6,7
C6: X7.C6 ; also sheet 1,2,3,4,5,6,7
C7: X7.C7 ; also sheet 1,2,3,4,5,6,7
C8: X7.C8 ; also sheet 2,3,4,5,6,7
C9: X7.C9 ; also sheet 2,3,4,5,6,7
C10: U7.13(B7) ; also sheet 1,2,3,4,5,6,7
C11: U7.15(B5) ; also sheet 1,2,3,4,5,6,7
C14: X7.C14 ; also sheet 1,2,3,4,5,6,7
C18: X7.C18 ; also sheet 2,3,4,5,6,7
C19: X7.C19 ; also sheet 2,3,4,5,6,7
C20: X7.C20 ; also sheet 2,3,4,5,6,7
C21: X7.C21 ; also sheet 2,3,4,5,6,7
C22: X7.C22 ; also sheet 2,3,4,5,6,7
C23: X7.C23 ; also sheet 2,3,4,5,6,7
C24: X7.C24 ; also sheet 1,2,3,4,5,6,7
C25: X7.C25 ; also sheet 1,2,3,4,5,6,7
C26: X7.C26 ; also sheet 1,2,3,4,5,6,7
C27: X7.C27 ; also sheet 2,3,4,5,6,7
C28: X7.C28 ; also sheet 2,3,4,5,6,7
C29: X7.C29 ; also sheet 1,2,3,4,5,6,7
C32: X7.C32 ; also sheet 2,3,4,5,6,7
CLK_6: U7.16(B4) ; also sheet 1
CS_6: U7.17(B3) ; also sheet 1
DGND: C15.P$2 C16.P$2 R21.P$1 U7.11(GND) X7.A17 X7.C17 ; also sheet 1,2,3,4,5,6,7
GND: X7.A1 X7.C1 ; also sheet 1,2,3,4,5,6,7
MISO_6: U7.20(B1) ; also sheet 1
MOSI_6: U7.18(B2) ; also sheet 1
N$55: U7.9(A8) X7.A10
N$56: U7.8(A7) X7.C10
N$57: U7.7(A6) X7.A11
N$58: U7.6(A5) X7.C11
N$59: U7.5(A4) X7.A12
N$60: U7.4(A3) X7.C12
N$61: U7.3(A2) X7.A13
N$62: U7.1(A1) X7.C13
N$63: C16.P$1 R22.P$1 R23.P$1 U7.19(VCCB)
OE_6: R21.P$2 U7.10(OE)

### Buses
A[1..32],C[1..32]

### Notes on the sheet
- d0
  .
  .
  .
  d3
- d0
  .
  .
  .
  d3
- clk
- cs
- mosi
- ... SPI ...
- miso
- To module (3v3 or 5v logic)
- To backplane (3v3 logic level)
- Cut short
  & solder to use
  3V3

## Library data of the parts
C1 C4-C16 = jqi_passives:C_MLCC_SMD
C2 C3 = jqi_passives:C_POL_SMD
L2 = jqi_passives:L_FERRITE_SMD
R1-R23 = jqi_passives:R_SMD
U1-U7 = Eurocard-Backplane-jqi:TXB0108: 8 channel level translator with auto-direction detect. http://www.ti.com/lit/ds/symlink/txb0108.pdf
X1-X7 X9 = Eurocard-Backplane-jqi:FAC64S: CONNECTOR female, 64 pins, block, type C, rows AC, grid 5.08 mm
X11 = Eurocard-Backplane-jqi:5566-4: Mini FIT connector 4 pol Source: http://www.molex.com; OC_FARNELL: unknown; OC_NEWARK: unknown